# EAGLE design MS3-adapter (EAGLE 7.6.0)
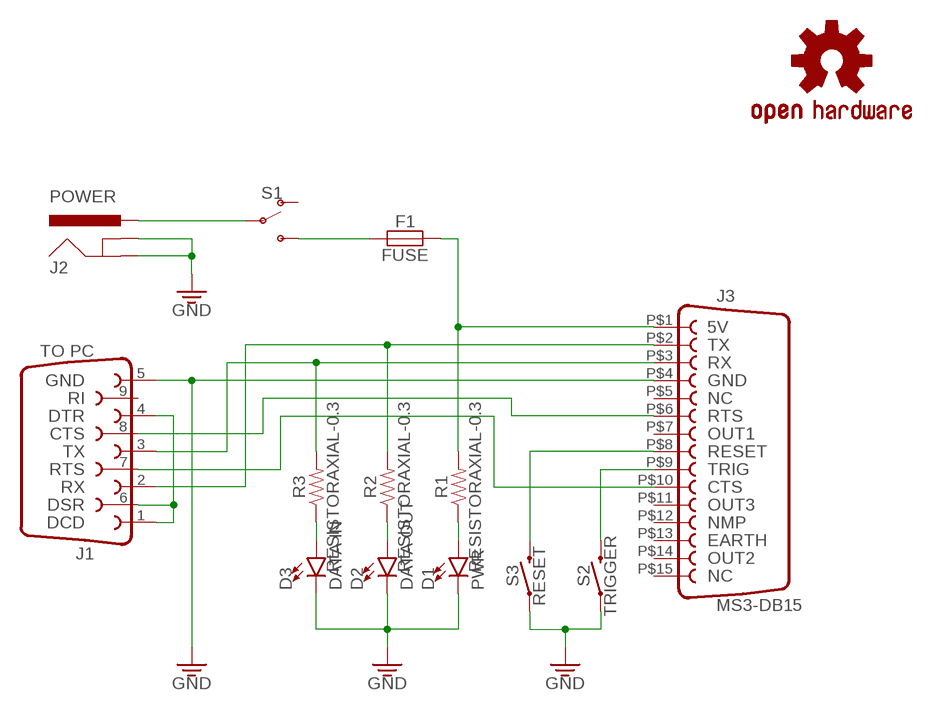
[diagram p0: schematic, sheet 1]

## Parts
D1  PWR  LED5MM  [LED_5MM]
D2  DATA OUT  LED5MM  [LED_5MM]
D3  DATA IN  LED5MM  [LED_5MM]
F1  FUSE  [FUSEHOLDER-PAIR-5MM]
J1  TO PC  DB9FEMALE  [DB9-FEMALE]
J2  POWER  POWER_JACK  [POWER_JACK_PTH]
J3  MS3-DB15  [DB15-MALE]
LOGO1  OSHW-LOGOS  [OSHW-LOGO-S]
R1  RESISTORAXIAL-0.3  [AXIAL-0.3]
R2  RESISTORAXIAL-0.3  [AXIAL-0.3]
R3  RESISTORAXIAL-0.3  [AXIAL-0.3]
S1  SWITCH-SPDT-PTH-11.6X4.0MM  [SWITCH_SPDT_PTH_11.6X4.0MM]
S2  TRIGGER  MOMENTARY-SWITCH-SPST-PTH-12MM  [TACTILE_SWITCH_PTH_12MM]
S3  RESET  MOMENTARY-SWITCH-SPST-PTH-12MM  [TACTILE_SWITCH_PTH_12MM]

## Nets
GND: D1.K(C) D2.K(C) D3.K(C) J1.5 J2.GND J2.GNDBREAK J3.P$4 S2.1 S3.1
N$1: J2.PWR S1.2(P)
N$2: F1.P$1 F1.P$2 S1.3(S)
N$3: J1.3 J3.P$3 R3.P$2
N$4: J1.2 J3.P$2 R2.P$2
N$5: J1.1 J1.4 J1.6
N$6: J1.7 J3.P$10
N$7: J1.8 J3.P$6
N$8: F1.P$3 F1.P$4 J3.P$1 R1.P$2
N$9: D2.A R2.P$1
N$10: D1.A R1.P$1
N$11: D3.A R3.P$1
N$12: J3.P$8 S3.3
N$13: J3.P$9 S2.3
Unconnected: J1.9 J3.P$5 J3.P$7 J3.P$11 J3.P$12 J3.P$13 J3.P$14 J3.P$15 S1.1(O)

## Library data of the parts
D1-D3 = MS3-adapter-components:LED: LED (Generic) Standard schematic elements and footprints for 5mm, 3mm, 1206, and 0603 sized LEDs. Generic LEDs with no color specified.
F1 = MS3-adapter-components:FUSE; VENDOR: Sparkfun; VENDOR_PN: COM-10166
J1 = MS3-adapter-components:DB9: DB9 Connector Modified from Sparkfun Library. Original description: Standard DB9 (D-Sub 9) serial connector. Can be used for CAN bus as well as RS485 and RS232. Footprint production proven. Here is the female version connector we sell at SparkFun: 9 Pin Female Serial Connector - PCB Mount <https://www.sparkfun.com/products/429> (PRT-00429) This connector has been used on the following SparkFun products: SparkFun RS232 Shifter - SMD <https://www.sparkfun.com/products/449> (PRT-00449) SparkFun RS232 Shifter SMD (No DB9) <https://www.sparkfun.com/products/8780> (PRT-08780); VENDOR: Sparkfun; VENDOR_PN: PRT-00429
J2 = MS3-adapter-components:POWER_JACK: Power Jack Connector This is the standard 5.5mm barrel jack for power. The PTH is the most common, proven, reliable, footprint. Here are the connectors we sell at SparkFun: DC Barrel Power Jack/Connector <https://www.sparkfun.com/products/119> (PRT-00119) DC Barrel Power Jack/Connector (SMD) <https://www.sparkfun.com/products/12748> (PRT-12748) DC Barrel Jack Adapter - Breadboard Compatible <https://www.sparkfun.com/products/10811> (PRT-10811); VENDOR: Sparkfun; VENDOR_PN: PRT-00119
J3 = MS3-adapter-components:MS3-DB15; VENDOR: Digikey; VENDOR_PN: A31927-ND
LOGO1 = MS3-adapter-components:OSHW-LOGO: Open-Source Hardware (OSHW) Logo This logo indicates the piece of hardware it is found on incorporates a OSHW license and/or adheres to the definition of open source hardware found here: http://freedomdefined.org/OSHW
R1-R3 = MS3-adapter-components:RESISTOR: Generic Resistor Package; VENDOR: Sparkfun
S1 = MS3-adapter-components:SWITCH-SPDT: Single Pole, Double Throw (SPDT) Switch Single-pole, double-throw (SPDT) switch. PTH-11.6X4.0MM SPDT Mini Power Switch <https://www.sparkfun.com/products/102> (COM-00102); VENDOR: Sparkfun; VENDOR_PN: COM-00102
S2 S3 = MS3-adapter-components:MOMENTARY-SWITCH-SPST: Momentary Switch (Pushbutton) - SPST Normally-open (NO) SPST momentary switches (buttons, pushbuttons). Variants PTH-12MM - 12mm square, through-hole Momentary Pushbutton Switch - 12mm Square <https://www.sparkfun.com/products/9190> (COM-09190); VENDOR: Sparkfun; VENDOR_PN: COM-09190

## Board
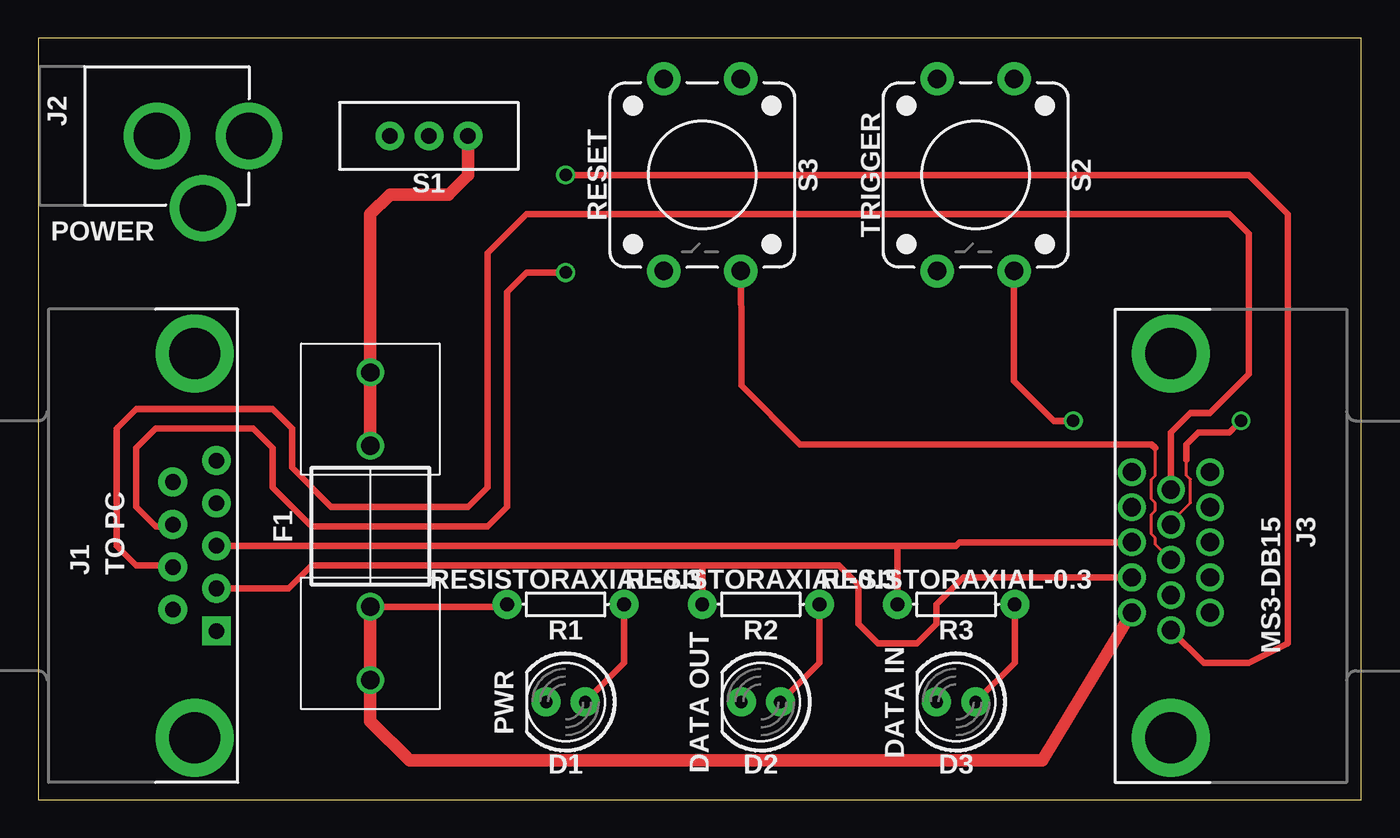
[diagram p1: board, top side]
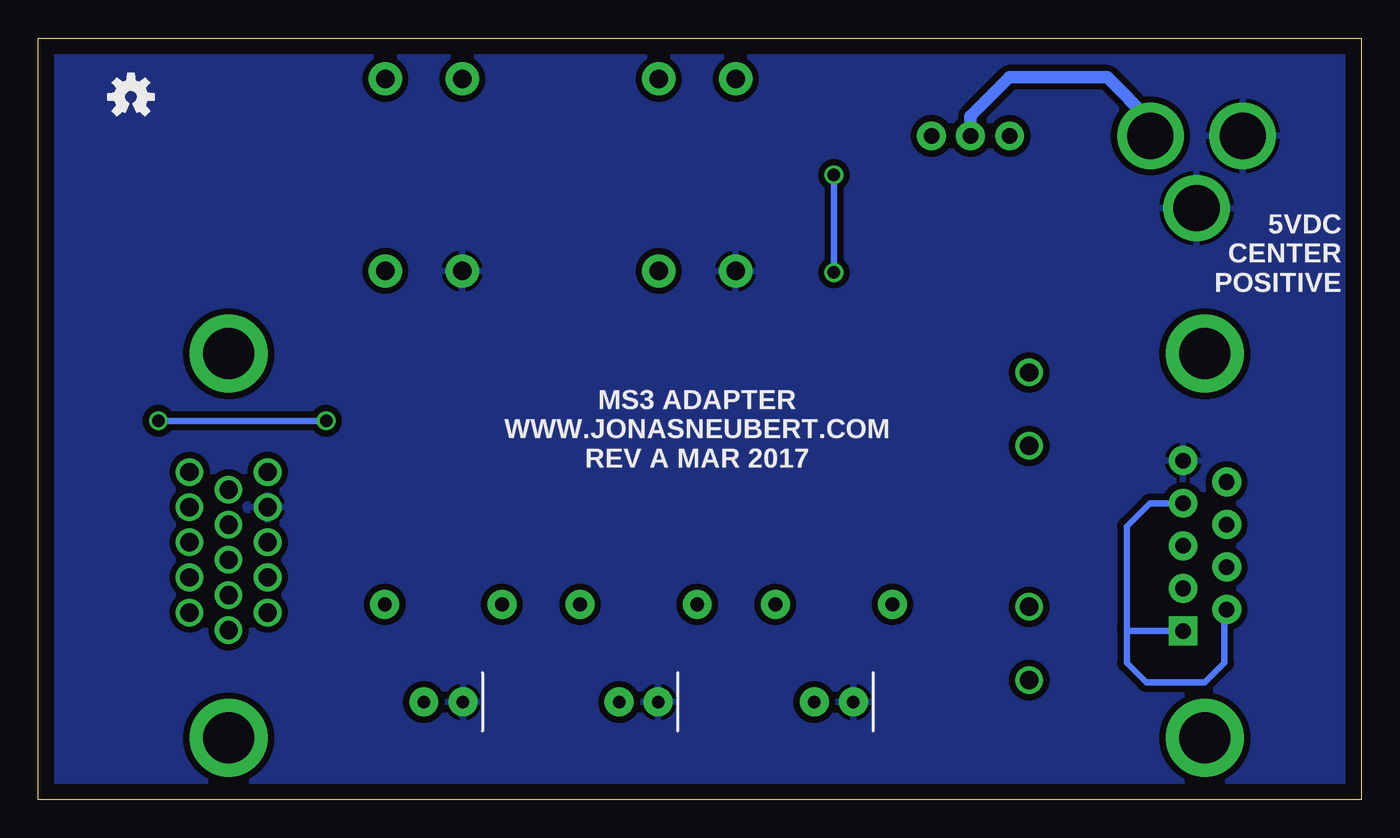
[diagram p2: board, bottom side, seen from below]

Size 86.03 x 49.52 mm. Coordinates in mm from the lower left corner, seen from the top.
Outline: 0,0 86.03,0 86.03,49.52 0,49.52 0,0
Copper layers (1*16): Top 0.035mm / dielectric 1.5mm / Bottom 0.035mm
Design rules "default": minimum track width 10mil, minimum drill 24mil, track to track 8mil, track to pad 8mil, pad to pad 8mil, via to via 8mil, smd to smd 8mil, copper to edge 40mil, drill to drill 8mil, minimum pad ring 10mil, minimum via ring 8mil, stop-mask expansion 4mil, vias tented up to drill 0mil, thermal gap 10mil

### Footprints (pad centres in the part's own frame; a part is rotated, then mirrored left to right if it is on the bottom)
LED_5MM = drill 0.813 pad 1.88: A -1.27,0; K 1.27,0
FUSEHOLDER-PAIR-5MM = drill 1.194: P$1 -10.008,0; P$2 -5.232,0; P$3 5.232,0; P$4 10.008,0
DB9-FEMALE = drill 1.016 pad 1.88 square: 1 -5.54,-1.42 | drill 1.016 pad 1.88: 2 -2.77,-1.42; 3 0,-1.42; 4 2.77,-1.42; 5 5.54,-1.42; 6 -4.15,1.42; 7 -1.38,1.42; 8 1.38,1.42; 9 4.15,1.42 | drill 3.302 pad 5.08: G1 -12.5,0; G2 12.5,0
POWER_JACK_PTH = drill 2.997 pad 4.318: GND 0,7.7; GNDBREAK 4.7,10.7; PWR 0,13.7
DB15-MALE = drill 3.302 pad 5.08: G1 -12.5,0; G2 12.5,0 | drill 1.194: P$1 4.343,-2.54; P$2 2.057,-2.54; P$3 -0.229,-2.54; P$4 -2.515,-2.54; P$5 -4.801,-2.54; P$6 5.486,0; P$7 3.2,0; P$8 0.914,0; P$9 -1.372,0; P$10 -3.658,0; P$11 4.343,2.54; P$12 2.057,2.54; P$13 -0.229,2.54; P$14 -2.515,2.54; P$15 -4.801,2.54
AXIAL-0.3 = drill 0.9 pad 1.88: P$1 -3.81,0; P$2 3.81,0
SWITCH_SPDT_PTH_11.6X4.0MM = drill 1.016 pad 1.88: 1 0,2.54; 2 0,0; 3 0,-2.54
TACTILE_SWITCH_PTH_12MM = drill 1.2 pad 2.159: 1 6.25,-2.5; 2 -6.25,-2.5; 3 6.25,2.5; 4 -6.25,2.5

### Placement (x,y rotation side)
D1  34.29,6.35 180 top
D2  46.99,6.35 180 top
D3  59.69,6.35 180 top
F1  21.59,17.78 270 top
J1  10.16,16.51 90 top
J2  0,43.18 270 top
J3  73.66,16.51 270 top
LOGO1  80.01,45.72 0 bottom
R1  34.29,12.7 180 top
R2  46.99,12.7 180 top
R3  59.69,12.7 180 top
S1  25.4,43.18 90 top
S2  60.96,40.64 270 top
S3  43.18,40.64 270 top

### Tracks (layer width: path | path; a pad name or v marks a point on that pad's centre or on a via)
GND
  pour Bottom (isolate 0.406): 0,49.53 86.36,49.53 86.36,0 0,0
N$1
  Bottom 0.813: J2.PWR 13.7,44.18 16.51,46.99 22.86,46.99 25.4,44.45 S1.2
N$2
  Top 0.813: S1.3 27.94,40.64 26.67,39.37 22.86,39.37 21.59,38.1 F1.P$1 F1.P$2
N$3
  Top 0.406: J1.3 55.88,16.51 | R3.P$2 55.88,16.51 | 55.88,16.51 59.69,16.51 59.92,16.74 J3.P$3
N$4
  Top 0.406: J1.2 16.28,13.74 17.78,15.24 43.18,15.24 | J3.P$2 60.17,14.45 58.42,12.7 58.42,11.43 57.15,10.16 54.61,10.16 53.34,11.43 53.34,13.97 52.07,15.24 43.18,15.24 | R2.P$2 43.18,15.24
N$5
  Bottom 0.406: J1.4 13.74,19.28 15.24,17.78 15.24,11.43 15.24,10.97 | 15.24,10.97 15.24,8.89 13.97,7.62 10.16,7.62 8.89,8.89 8.89,12.21 J1.6 | J1.1 15.24,10.97
N$6
  Top 0.406: J3.P$10 73.66,23.88 74.93,25.15 76.2,25.15 78.74,27.69 78.74,36.83 77.47,38.1 31.75,38.1 29.21,35.56 29.21,20.32 27.94,19.05 19.05,19.05 16.51,21.59 16.51,24.13 15.24,25.4 6.35,25.4 5.08,24.13 5.08,16.51 6.35,15.24 8.63,15.24 J1.7
N$7  (via drill 0.81)
  Top 0.406: J3.P$6 75.79,8.89 78.74,8.89 81.28,10.16 81.28,38.1 78.74,40.64 v34.29,40.64 | v34.29,34.29 31.75,34.29 30.48,33.02 30.48,19.05 29.21,17.78 17.78,17.78 15.24,20.32 15.24,22.86 13.97,24.13 7.62,24.13 6.35,22.86 6.35,19.05 7.62,17.78 8.63,17.78 J1.8
  Bottom 0.406: v34.29,40.64 v34.29,34.29
N$8
  Top 0.406: F1.P$3 30.33,12.55 R1.P$2
  Top 0.813: F1.P$3 F1.P$4 21.59,5.08 24.13,2.54 65.3,2.54 J3.P$1
N$9
  Top 0.406: R2.P$1 50.8,8.89 D2.A
N$10
  Top 0.406: R1.P$1 38.1,8.89 D1.A
N$11
  Top 0.406: R3.P$1 63.5,8.89 D3.A
N$12
  Top 0.203: J3.P$8 72.64,16.61 72.64,17.02 72.39,17.27 72.39,18.54 72.64,18.8 72.64,19.3 72.39,19.56 72.39,20.83 72.64,21.08 72.64,22.86
  Top 0.406: 72.64,22.86 72.39,23.11 49.53,23.11 45.72,26.92 45.72,31.38 S3.3
N$13  (via drill 0.81)
  Top 0.203: J3.P$9 73.66,18.03 74.93,19.3 74.93,20.83 74.68,21.08 74.68,22.1
  Top 0.406: 74.68,22.1 74.68,23.11 75.44,23.88 77.47,23.88 v78.23,24.64 | S2.3 63.46,27.22 66.04,24.64 v67.31,24.64
  Bottom 0.406: v67.31,24.64 v78.23,24.64

### Text on the board
bPlace: 5VDC / CENTER / POSITIVE | MS3 ADAPTER / WWW.JONASNEUBERT.COM / REV A MAR 2017